# Altium schematic sheet outputdiode.SchDoc
size A; DrawnBy: Hoang Pham; Engineer: Hoang Pham; SheetNumber: 3; SheetTotal: 4
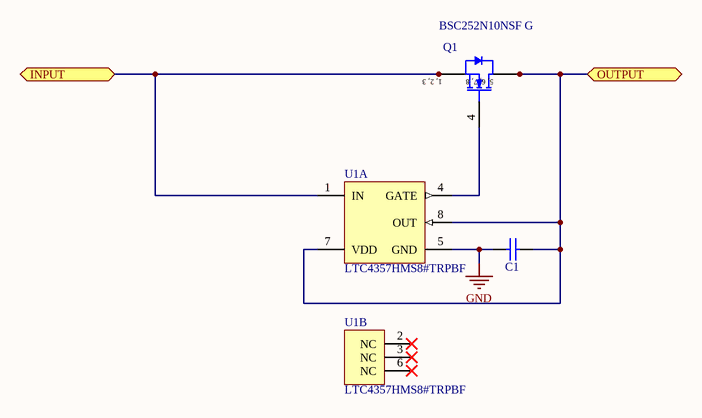
[diagram p0: outputdiode.SchDoc]

## Parts
C1  CAP 470nF 100V 0805(2012)  [CAPC0805(2012)145_M]  (value not drawn)
Q1  BSC252N10NSF G  [INF-PG-TDSON-8-1_V]
U1  LTC4357HMS8#TRPBF  [LT-MS8-8_M]  (parts A,B of 2)

## Ports
INPUT, OUTPUT

## Nets
GND: C1.1 U1.5(GND)
INPUT: Q1.1(SOURCE) Q1.2(SOURCE) Q1.3(SOURCE) U1.1(IN) ; port INPUT
OUTPUT: C1.2 Q1.5(DRAIN) Q1.6(DRAIN) Q1.7(DRAIN) Q1.8(DRAIN) U1.7(VDD) U1.8(OUT) ; port OUTPUT
NetQ1_4: Q1.4(GATE) U1.4(GATE)

Not connected (* = marked no-connect by the designer): U1 2(NC)* 3(NC)* 6(NC)*

## Notes on the sheet
- (in symbol CMP-1091-00069-1) 1, 2, 3; 5, 6, 7, 8

## Library data of the parts
C1 = CMP-1036-04659-1: CAP 470nF 100V ±10% 0805 (2012 Metric) Thickness 1.45mm SMD; Case-Metric: 2012; Tolerance: Â±10%; Case-EIA: 0805; Technology: SMT; Max Thickness: 1.45 mm; Rated Voltage: 100 V; Value: 470nF
Q1 = CMP-1091-00069-1: N-Channel OptiMOS 2 Power-Transistor, 100 V VDS, 40 A ID, -55 to 150 degC, PG-TDSON-8-1, Reel, Green; Manufacturer: Infineon; IDpuls (max): 160Â A; QG: 13Â nC; RDS (on) (max): 25.2Â mOhm; VGS(th) (min): 2Â V; VGS(th) (max): 4Â V; RthJC (max): 1.6Â K/W; RthJA (max): 62 K/W; VDS (max): 100Â V; ID (max): 40Â A; Ptot (max): 78Â W; Green: TRUE; Polarity: N; PackageDescription: 8-Pin Plastic (Green) Thin Dual Small Outline Non-Leaded Package, 5.15 x 5.9 mm Body, 1.27 mm Pitch; DatasheetVersion: Rev. 2.08; ComponentLink1URL: http://www.infineon.com/; ComponentLink1Description: Manufacturer URL; ComponentLink3Description: Package Specification; Packing: Reel; ComponentLink3URL: http://www.infineon.com/cms/packages/SMD_-_Surface_Mounted_Devices/P-PG-TDSON/P-PG-TDSON-08-01x_2x_3.html?__locale=en; ComponentLink2URL: http://www.infineon.com/dgdl/BSC252N10NSF+Rev28.pdf?folderId=db3a304313b8b5a60113cee8763b02d7&fileId=db3a30431b3e89eb011b498909e97b17; ComponentLink2Description: Datasheet; Mounting Technology: Surface Mount; Halogen-free: TRUE; PackageReference: PG-TDSON-8-1; PartNumber: BSC252N10NSF G; Rth: 1.6Â K/W
U1 = CMP-0479-00227-1: Positive High Voltage Ideal Diode Controller, 9 to 80 V Vin, 8-pin SOP (MS8-8), -40 to 125 degC, Pb-Free, Tape and Reel; Manufacturer: Linear Technology; Ideal Diode: Single, External, N-Channel; Mounting Technology: Surface Mount; PartNumber: LTC4357HMS8#TRPBF; PackageVersion: Rev. G, 03/2012; PackageReference: MS8-8; RoHS: TRUE; Packing: Tape and Reel; DatasheetVersion: Rev. D; ComponentLink3URL: http://cds.linear.com/docs/en/packaging/05081660_G_MS8.pdf; ComponentLink2Description: Datasheet; PackageDescription: 8-Pin Plastic MSOP, Body 3 x 3 mm, Pitch 0.65 mm; ComponentLink2URL: http://cds.linear.com/docs/en/datasheet/4357fd.pdf; ComponentLink1Description: Manufacturer URL; ComponentLink3Description: Package Specification; ComponentLink1URL: http://www.linear.com/